# EAGLE design board vending (EAGLE 9.6.2)
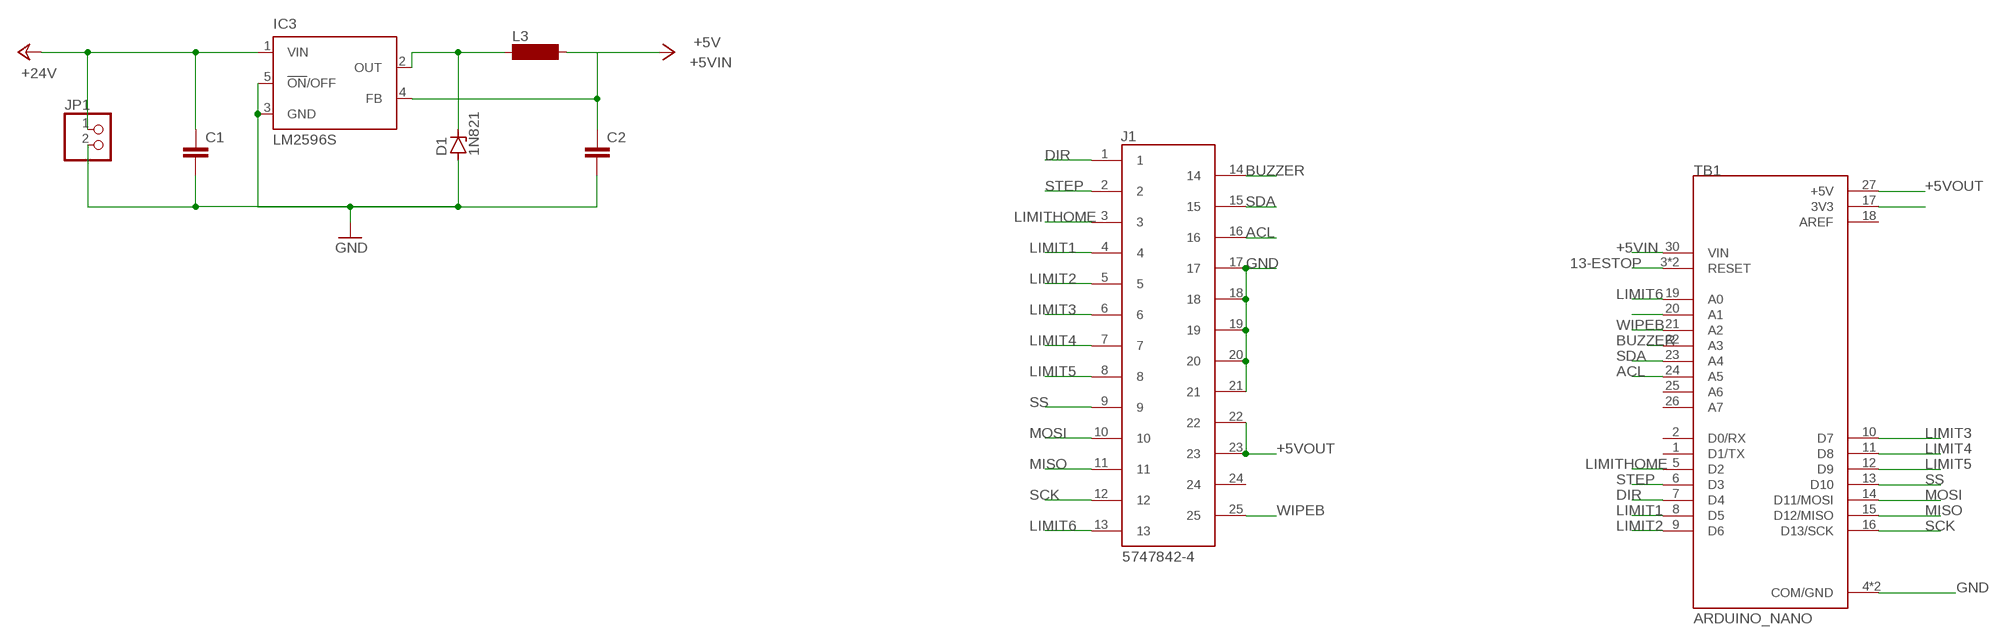
[diagram p0: schematic, sheet 1]

## Parts
C1  C5/7.2  [C5B7.2]
C2  C5/7.2  [C5B7.2]
D1  1N821  [DO35Z10]
IC3  LM2596S  [TO263-5]
J1  5747842-4  [TE_5747842-4]
JP1  PINHD-1X2  [1X02]
L3  BS75  [BS75]
TB1  ARDUINO_NANO  [SHIELD_ARDUINO_NANO]

## Nets
13-ESTOP: TB1.3(RESET) TB1.28(RESET)
+5VIN: C2.1 IC3.4(FB) L3.2 TB1.30(VIN) ; supply symbol labelled +5V
+5VOUT: J1.22 J1.23 TB1.27(+5V)
+24V: C1.1 IC3.1(VIN) JP1.1
ACL: J1.16 TB1.24(A5)
BUZZER: J1.14 TB1.22(A3)
DIR: J1.1 TB1.7(D4)
GND: C1.2 C2.2 D1.A IC3.3(GND) IC3.5(!ON!/OFF) J1.17 J1.18 J1.19 J1.20 J1.21 JP1.2 TB1.4(COM/GND) TB1.29(COM/GND)
LIMIT1: J1.4 TB1.8(D5)
LIMIT2: J1.5 TB1.9(D6)
LIMIT3: J1.6 TB1.10(D7)
LIMIT4: J1.7 TB1.11(D8)
LIMIT5: J1.8 TB1.12(D9)
LIMIT6: J1.13 TB1.19(A0)
LIMITHOME: J1.3 TB1.5(D2)
MISO: J1.11 TB1.15(D12/MISO)
MOSI: J1.10 TB1.14(D11/MOSI)
N$2: D1.C IC3.2(OUT) L3.1
N$29: TB1.20(A1)
N$46: TB1.17(3V3)
SCK: J1.12 TB1.16(D13/SCK)
SDA: J1.15 TB1.23(A4)
SS: J1.9 TB1.13(D10)
STEP: J1.2 TB1.6(D3)
WIPEB: J1.25 TB1.21(A2)
Unconnected: J1.24 TB1.1(D1/TX) TB1.2(D0/RX) TB1.25(A6) TB1.26(A7)

## Power pins joined to a net without a drawn wire
AREF: TB1.18(AREF)

## Library data of the parts
C1 C2 = capacitor-wima:C: CAPACITOR naming: grid - package width
D1 = diode:1N821: Reference DIODE temperature compensated, 6,2 V
IC3 = national-semiconductor:LM2596: SIMPLE SWITCHER® Power Converter 150 kHz 3A Step-Down Voltage Regulator Source: http://www.national.com/ds/LM/LM2596.pdf; MF: NATIONAL SEMICONDUCTOR; MPN: LM2596S-ADJ/NOPB; OC_FARNELL: 9494367; OC_NEWARK: 41K3842
J1 = 5747842-4:5747842-4: CONN D-SUB PLUG 25POS R/A SOLDER Check availability <https://pricing.snapeda.com/parts/5747842-4/TE%20Connectivity/view-part?ref=eda>; AVAILABILITY: In Stock; COMMENT: 5747842-4; DESCRIPTION: D Sub Connector, Amplimite HD-20, Amplimite HD-20 Series, DB, Plug, 25, Metal, Solder; EU_ROHS_COMPLIANCE: Compliant; MF: TE Connectivity; MP: 5747842-4; PACKAGE: None; PRICE: None; PURCHASE-URL: https://pricing.snapeda.com/search/part/5747842-4/?ref=eda
JP1 = pinhead:PINHD-1X2: PIN HEADER
L3 = inductor-neosid:BS: INDUCTOR nominal inductance, magnetically screened; OC_FARNELL: unknown; OC_NEWARK: unknown
TB1 = ARDUINO_NANO:ARDUINO_NANO: Arduino Nano, Through Hole Check availability <https://pricing.snapeda.com/parts/Arduino%20Nano/Arduino/view-part?ref=eda>; AVAILABILITY: Not in stock; DESCRIPTION: Small, complete, and breadboard-friendly board based on the ATmega328 (Arduino Nano 3.x); MF: Arduino; MP: Arduino Nano; PACKAGE: Non-Standard Arduino; PRICE: None

## Board
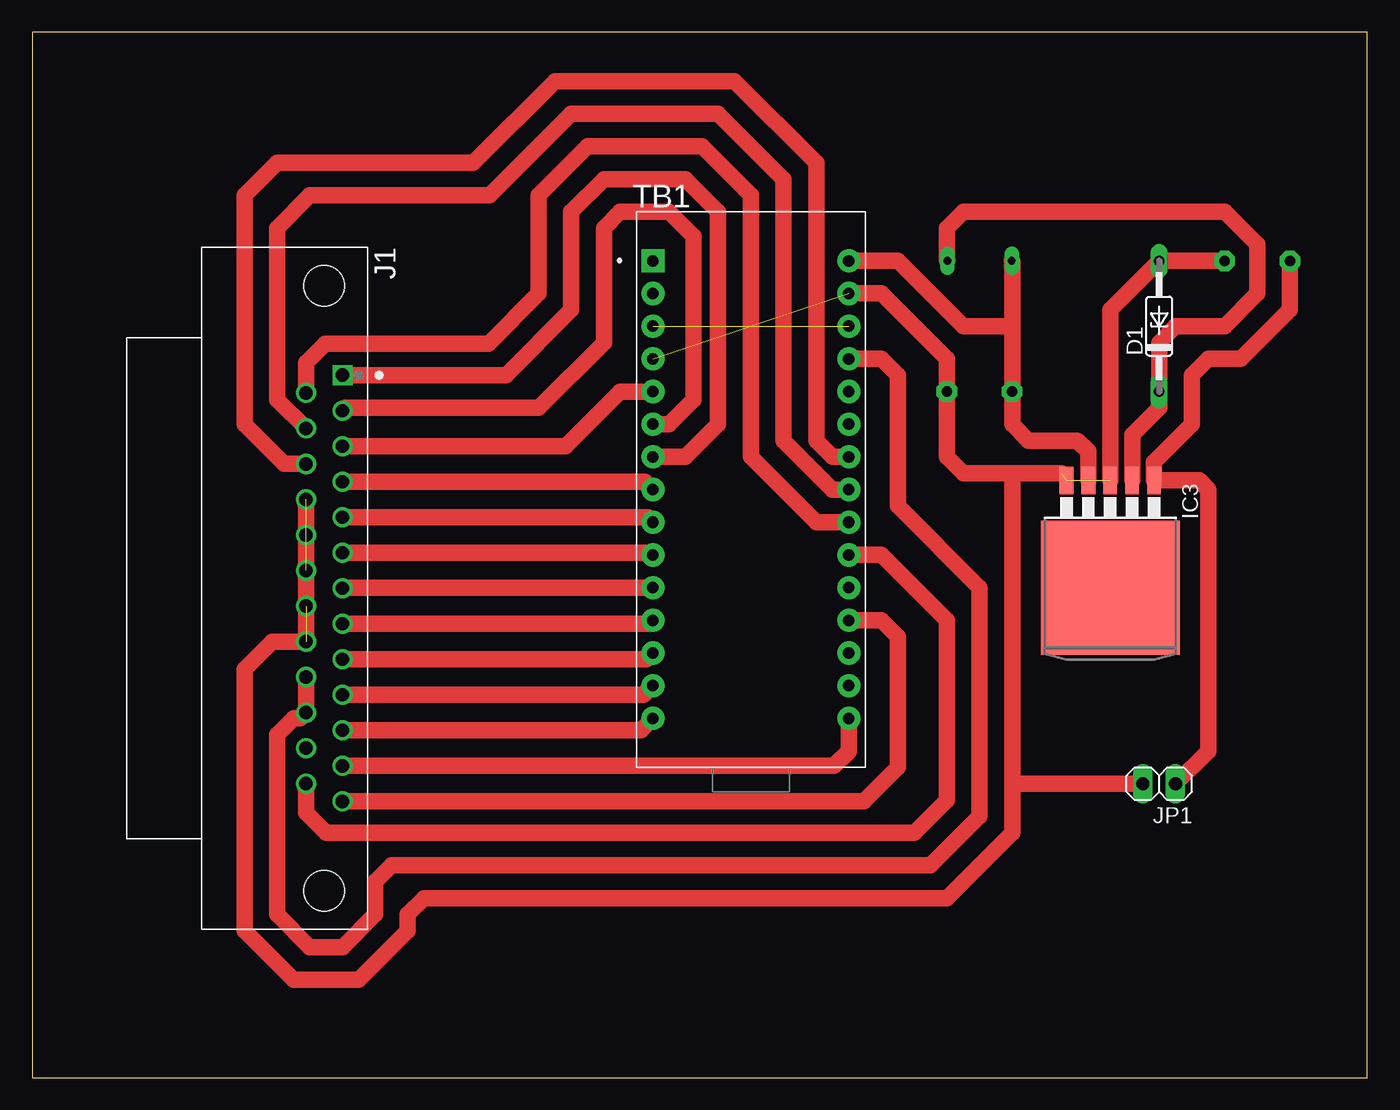
[diagram p1: board, top side]
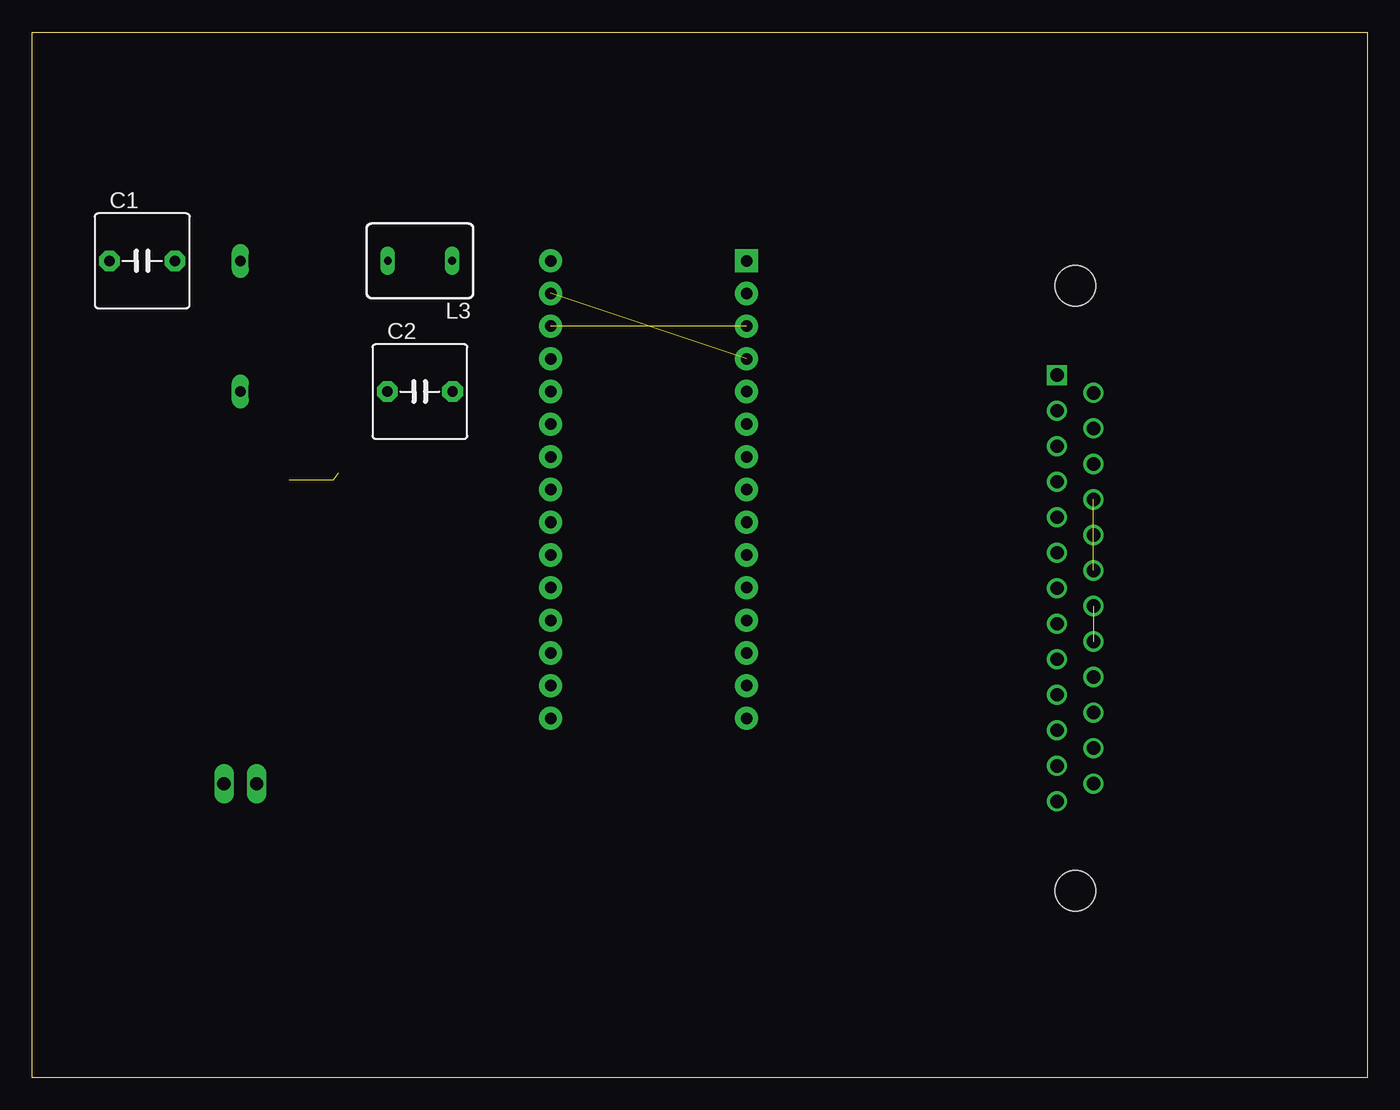
[diagram p2: board, bottom side, seen from below]

Size 103.81 x 81.27 mm. Coordinates in mm from the lower left corner, seen from the top.
Outline: 0,0 103.81,0 103.81,81.27 0,81.27 0,0
Copper layers (1*16): Top 0.035mm / dielectric 1.5mm / Bottom 0.035mm
Design rules "default": minimum track width 6mil, minimum drill 0.35mm, track to track 6mil, track to pad 6mil, pad to pad 6mil, via to via 6mil, smd to smd 6mil, copper to edge 40mil, drill to drill 6mil, minimum pad ring 10mil, minimum via ring 8mil, stop-mask expansion 4mil, vias tented up to drill 0mil, thermal gap 10mil

### Footprints (pad centres in the part's own frame; a part is rotated, then mirrored left to right if it is on the bottom)
C5B7.2 = drill 0.813 pad 1.6 octagon: 1 -2.54,0; 2 2.54,0
DO35Z10 = drill 0.813 long: A 5.08,0; C -5.08,0
TO263-5 = smd 1.067 x 2.159: 1 -3.404,-5.791; 2 -1.702,-5.791; 3 0,-5.791; 4 1.702,-5.791; 5 3.404,-5.791 | smd 10.8 x 10.41: 6 0,2.54
TE_5747842-4 = drill 1.04 square: 1 0,0 | drill 1.04: 2 2.76,0; 3 5.52,0; 4 8.28,0; 5 11.04,0; 6 13.8,0; 7 16.56,0; 8 19.32,0; 9 22.08,0; 10 24.84,0; 11 27.6,0; 12 30.36,0; 13 33.12,0; 14 1.38,-2.84; 15 4.14,-2.84; 16 6.9,-2.84; 17 9.66,-2.84; 18 12.42,-2.84; 19 15.18,-2.84; 20 17.94,-2.84; 21 20.7,-2.84; 22 23.46,-2.84; 23 26.22,-2.84; 24 28.98,-2.84; 25 31.74,-2.84 | hole 3.18: -6.96,-1.42; 40.08,-1.42
1X02 = drill 1.016 long: 1 -1.27,0; 2 1.27,0
BS75 = drill 0.6 long: 1 -2.5,0; 2 2.5,0
SHIELD_ARDUINO_NANO = drill 0.9 pad 1.8 square: 1 -7.62,17.78 | drill 0.9 pad 1.8: 2 -7.62,15.24; 3 -7.62,12.7; 4 -7.62,10.16; 5 -7.62,7.62; 6 -7.62,5.08; 7 -7.62,2.54; 8 -7.62,0; 9 -7.62,-2.54; 10 -7.62,-5.08; 11 -7.62,-7.62; 12 -7.62,-10.16; 13 -7.62,-12.7; 14 -7.62,-15.24; 15 -7.62,-17.78; 16 7.62,-17.78; 17 7.62,-15.24; 18 7.62,-12.7; 19 7.62,-10.16; 20 7.62,-7.62; 21 7.62,-5.08; 22 7.62,-2.54; 23 7.62,0; 24 7.62,2.54; 25 7.62,5.08; 26 7.62,7.62; 27 7.62,10.16; 28 7.62,12.7; 29 7.62,15.24; 30 7.62,17.78

### Placement (x,y rotation side)
C1  95.25,63.5 0 bottom
C2  73.66,53.34 0 bottom
D1  87.63,58.42 90 top
IC3  83.82,40.64 180 top
J1  24.13,54.61 270 top
JP1  87.63,22.86 180 top
L3  73.66,63.5 180 bottom
TB1  55.88,45.72 0 top

### Tracks (layer width: path | path; a pad name or v marks a point on that pad's centre or on a via)
13-ESTOP  (1 unrouted)
+5VIN  (via drill 0.35)
  Top 1.27: TB1.30 67.31,63.5 72.39,58.42 76.2,58.42 | 76.2,58.42 v76.2,63.46 L3.2 | 76.2,58.42 C2.1 76.2,50.8 77.47,49.53 81.28,49.53 82.12,48.69 IC3.4
+5VOUT
  Top 1.27: J1.22 J1.23 20.84,27.94 20.32,27.94 19.05,26.67 19.05,12.7 21.59,10.16 24.13,10.16 26.67,12.7 26.67,15.24 27.94,16.51 69.85,16.51 73.66,20.32 73.66,38.1 67.31,44.45 67.31,54.61 66.04,55.88 TB1.27
+24V
  Top 1.27: C1.1 97.79,59.69 93.98,55.88 91.44,55.88 90.17,54.61 90.17,50.8 87.22,47.85 IC3.1 90.73,46.43 91.44,45.72 91.44,25.4 JP1.1
ACL
  Top 1.27: J1.16 19.6,47.71 16.51,50.8 16.51,66.04 16.51,67.31 16.51,68.58 19.05,71.12 34.29,71.12 40.64,77.47 54.61,77.47 60.96,71.12 60.96,49.53 62.23,48.26 TB1.24
BUZZER
  Top 1.27: TB1.22 60.96,43.18 55.88,48.26 55.88,68.58 52.07,72.39 43.18,72.39 39.37,68.58 39.37,60.96 35.47,57.06 22.77,57.06 21.29,55.58 J1.14
DIR
  Top 1.27: J1.1 36.83,54.61 41.91,59.69 41.91,67.31 44.45,69.85 50.8,69.85 53.34,67.31 53.34,50.8 50.8,48.26 TB1.7
GND  (6 unrouted)
  Top 1.27: J1.17 J1.21 18.67,33.91 16.51,31.75 16.51,11.43 20.32,7.62 25.4,7.62 29.21,11.43 29.21,12.7 30.48,13.97 71.12,13.97 76.2,19.05 76.2,22.86 | TB1.29 66.04,60.96 71.12,55.88 C2.2 71.12,48.26 72.39,46.99 76.2,46.99 | 76.2,46.99 80.01,46.99 | IC3.3 83.82,59.69 D1.A C1.2 | 76.2,22.86 76.2,46.99 | 76.2,22.86 JP1.2
LIMIT1
  Top 1.27: J1.4 47.65,46.33 TB1.8
LIMIT2
  Top 1.27: J1.5 47.87,43.57 TB1.9
LIMIT3
  Top 1.27: J1.6 48.09,40.81 TB1.10
LIMIT4
  Top 1.27: J1.7 24.18,38.1 TB1.11
LIMIT5
  Top 1.27: J1.8 47.99,35.29 TB1.12
LIMIT6
  Top 1.27: J1.13 64.67,21.49 67.31,24.13 67.31,34.29 66.04,35.56 TB1.19
LIMITHOME
  Top 1.27: J1.3 41.47,49.09 45.72,53.34 TB1.5
MISO
  Top 1.27: J1.11 47.33,27.01 TB1.15
MOSI
  Top 1.27: J1.10 47.55,29.77 TB1.14
N$2
  Top 1.27: L3.1 71.12,63.54 71.12,66.04 72.39,67.31 92.71,67.31 95.25,64.77 95.25,60.96 92.71,58.42 88.9,58.42 87.63,57.15 D1.C 87.63,52.07 85.52,49.96 IC3.2
SCK
  Top 1.27: J1.12 27.94,24.25 29.09,24.25 62.35,24.25 63.5,25.4 TB1.16
SDA
  Top 1.27: J1.15 19.05,52.71 19.05,66.04 21.59,68.58 35.56,68.58 41.91,74.93 53.34,74.93 58.42,69.85 58.42,49.53 62.23,45.72 TB1.23
SS
  Top 1.27: J1.9 47.77,32.53 TB1.13
STEP
  Top 1.27: J1.2 24.35,52.07 39.37,52.07 44.45,57.15 44.45,66.04 45.72,67.31 49.53,67.31 51.44,65.41 51.44,52.7 49.53,50.8 TB1.6
WIPEB
  Top 1.27: J1.25 21.29,20.62 22.86,19.05 68.58,19.05 71.12,21.59 71.12,35.56 66.04,40.64 TB1.21